# EasyEDA schematic schematic.json
TITLE: Sheet_1; REV: 1.0; Date: 2026-08-25; Sheet: 1/1; Drawn By: prathamrupera0; Company: Your Company
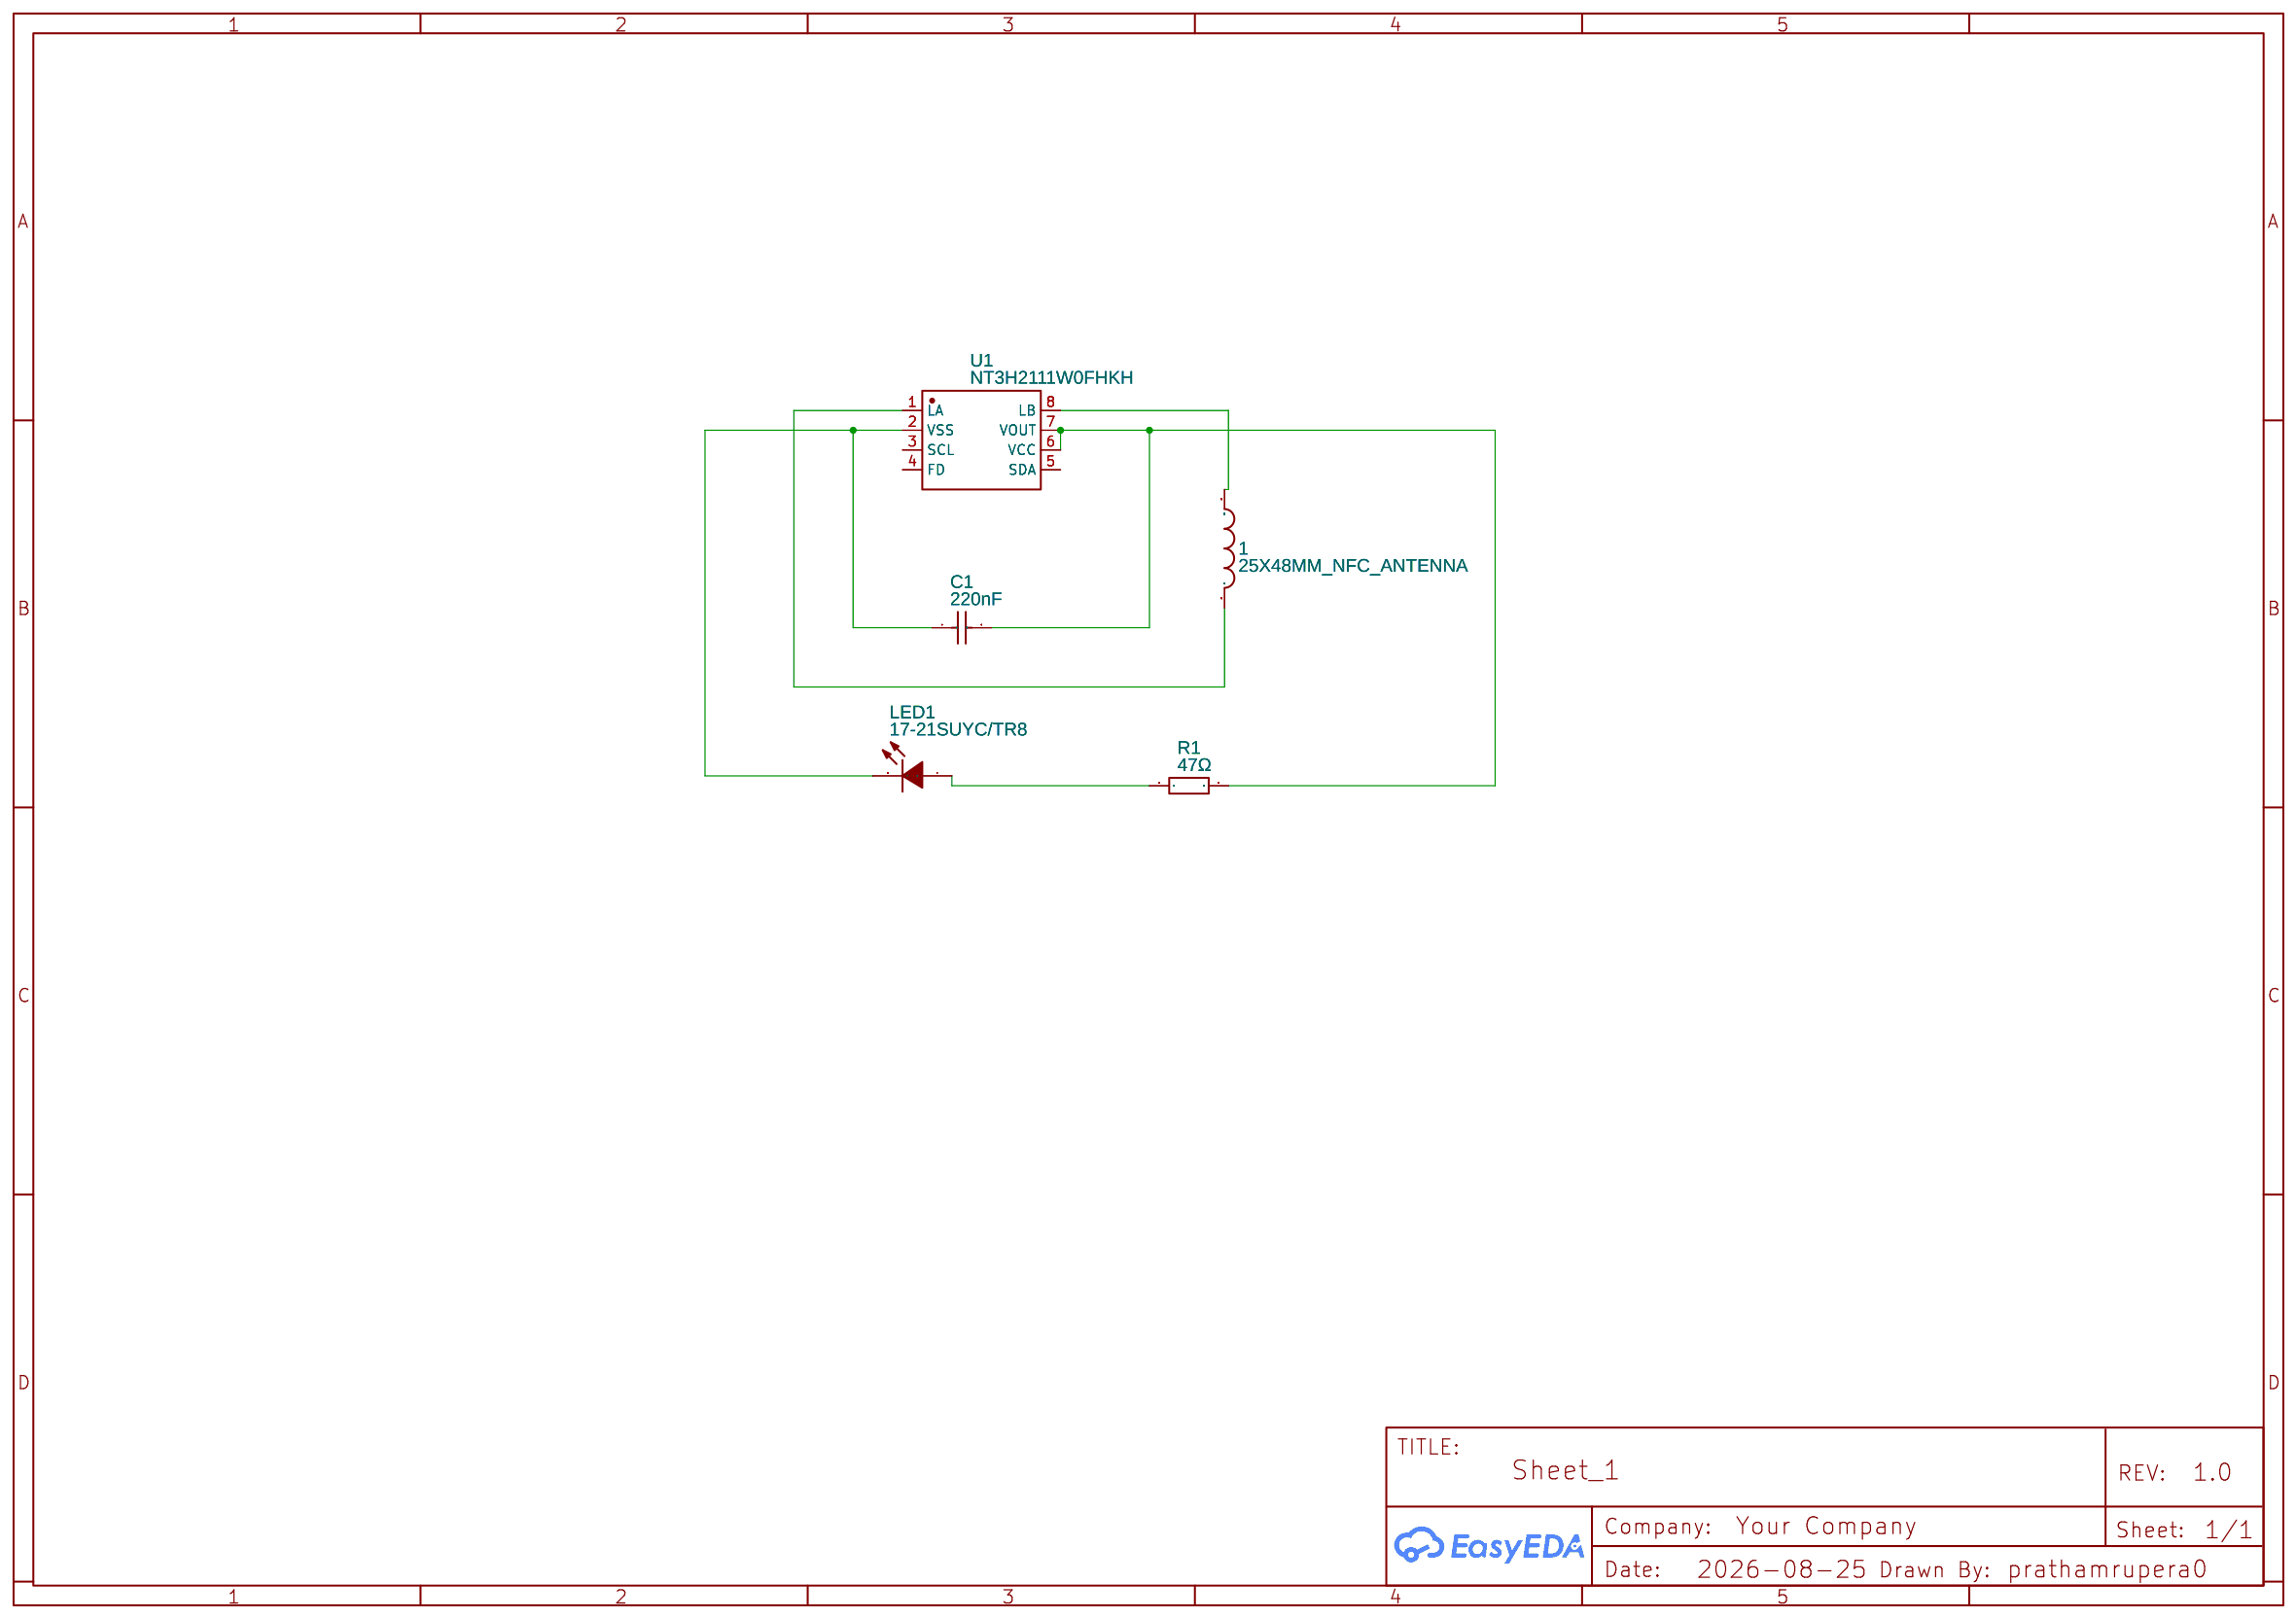
[diagram p0: schematic sheet]

## Parts
1  25X48MM_NFC_ANTENNA  [25X48MM_NFC_ANTENNA]
C1  220nF  [C0805]
LED1  17-21SUYC/TR8  [LED0805-R-RD]
R1  47Ω  [RES-TH_BD5.5-L16.0-P20.00-D0.8]
U1  NT3H2111W0FHKH  [XQFN-8_L1.6-W1.6-P0.50-BL_NT3H2111W0FHKH]

## Library data of the parts
1 = 25X48MM_NFC_ANTENNA: Contributor: dnonoo
C1 = CL21B224KBFNNNE: Supplier: LCSC; Manufacturer: SAMSUNG(三星); Supplier Part: C5378; JLCPCB Part Class: Basic Part
LED1 = 17-21SUYC/TR8: Supplier: LCSC; Manufacturer: KENTO; Manufacturer Part: KT-0805黄灯; Supplier Part: C2296; JLCPCB Part Class: Basic Part
R1 = 47Ω(470) ±5%: Contributor: LCSC; Supplier: LCSC; Supplier Part: C209824; Manufacturer: CCO(千志电子); Manufacturer Part: KNP2W-47Ω±5% MK型; JLCPCB Part Class: Extended Part
U1 = NT3H2111W0FHKH: Contributor: LCSC; Supplier: LCSC; Supplier Part: C710403; Manufacturer: NXP(恩智浦); JLCPCB Part Class: Extended Part

## Nets
Net-(1-P$1): 1.P$1 U1.8(LB)
Net-(1-P$2): 1.P$2 U1.1(LA)
Net-(C1-1): C1.1 LED1.2(-) U1.2(VSS)
Net-(C1-2): C1.2 R1.2 U1.6(VCC) U1.7(VOUT)
Net-(LED1-1): LED1.1(+) R1.1

Not connected (* = marked no-connect by the designer): U1 3(SCL) 4(FD) 5(SDA)
